# EAGLE design LEDTestBrd (EAGLE 6.5.0)
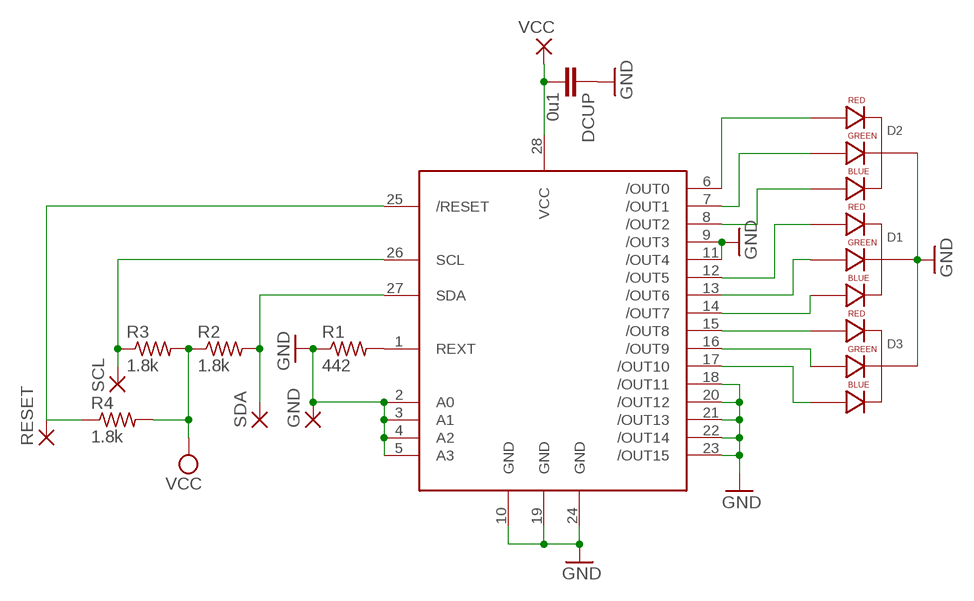
[diagram p0: schematic, sheet 1]

## Parts
D1  LED-RGB-CC-THRUCLEAR  [LED-RGB-THRU]
D2  LED-RGB-CC-THRUCLEAR  [LED-RGB-THRU]
D3  LED-RGB-CC-THRUCLEAR  [LED-RGB-THRU]
DCUP  0u1  CAP0402-CAP  [0402-CAP]
GND  2,15/1,0  [2,15/1,0]
R1  442  R-US_R0402  [R0402]
R2  1.8k  R-US_R0402  [R0402]
R3  1.8k  R-US_R0402  [R0402]
R4  1.8k  R-US_R0402  [R0402]
RESET  2,15/1,0  [2,15/1,0]
SCL  2,15/1,0  [2,15/1,0]
SDA  2,15/1,0  [2,15/1,0]
U$1  TLC59116  [TSSOP28]
VCC  2,15/1,0  [2,15/1,0]

## Nets
GND: D1.2(CATHODE) D2.2(CATHODE) D3.2(CATHODE) DCUP.1 GND.1(P) R1.1 U$1.2(A0) U$1.3(A1) U$1.4(A2) U$1.5(A3) U$1.9(/OUT3) U$1.10(GND) U$1.11(/OUT4) U$1.18(/OUT11) U$1.19(GND) U$1.20(/OUT12) U$1.21(/OUT13) U$1.22(/OUT14) U$1.23(/OUT15) U$1.24(GND)
N$1: D1.1(RED_CATHODE) U$1.12(/OUT5)
N$2: D2.1(RED_CATHODE) U$1.6(/OUT0)
N$3: D2.3(GREEN_CATHODE) U$1.7(/OUT1)
N$4: D2.4(BLUE_CATHODE) U$1.8(/OUT2)
N$5: D1.3(GREEN_CATHODE) U$1.13(/OUT6)
N$6: D1.4(BLUE_CATHODE) U$1.14(/OUT7)
N$7: D3.1(RED_CATHODE) U$1.15(/OUT8)
N$8: D3.3(GREEN_CATHODE) U$1.16(/OUT9)
N$9: D3.4(BLUE_CATHODE) U$1.17(/OUT10)
N$10: R1.2 U$1.1(REXT)
RESET: R4.1 RESET.1(P) U$1.25(/RESET)
SCL: R3.1 SCL.1(P) U$1.26(SCL)
SDA: R2.2 SDA.1(P) U$1.27(SDA)
VCC: DCUP.2 R2.1 R3.2 R4.2 U$1.28(VCC) VCC.1(P)

## Library data of the parts
D1-D3 = SparkFun-LED:LED-RGB-CC-THRU: RGB Through-hole common cathode LED SparkFun Storefront: COM-00105 (Clear) COM-09264 (Diffuse); PROD_ID: DIO-08418
DCUP = SparkFun-Capacitors:CAP: Capacitor Standard 0603 ceramic capacitor, and 0.1" leaded capacitor.
GND RESET SCL SDA VCC = wirepad:2,15/1,0: THROUGH-HOLE PAD
R1-R4 = resistor:R-US_: RESISTOR, American symbol
U$1 = tlc59116:TLC59116

## Board
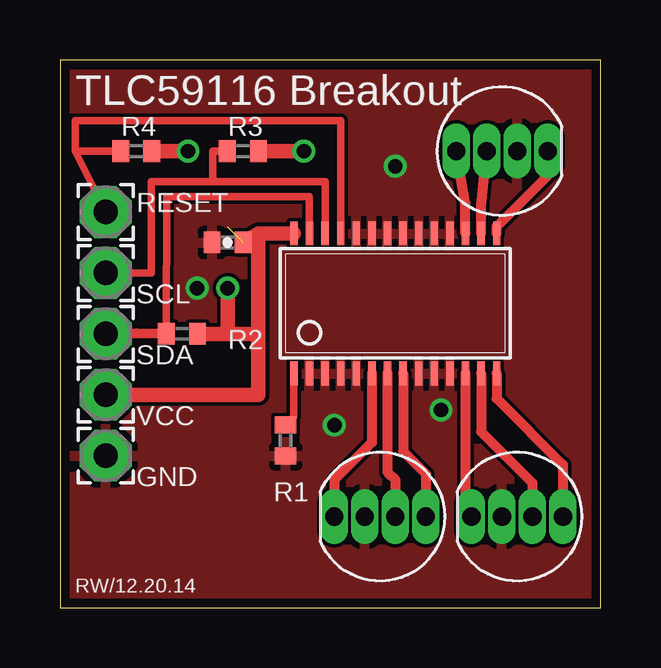
[diagram p1: board, top side]
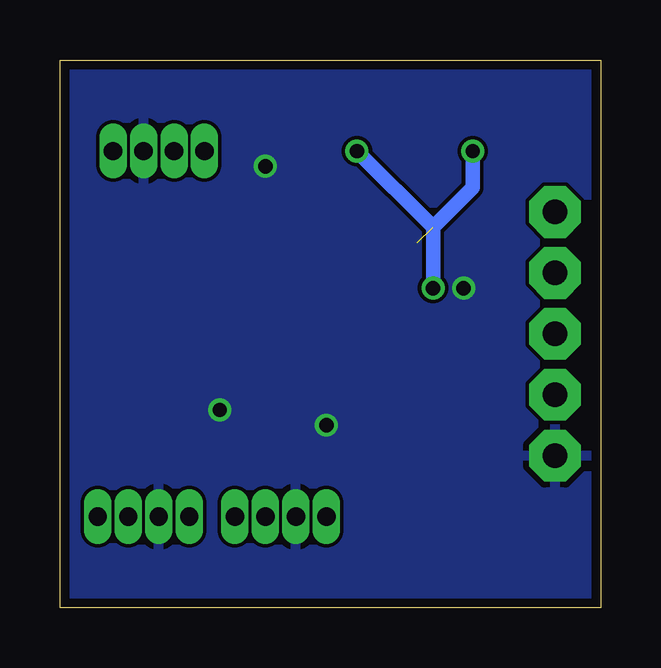
[diagram p2: board, bottom side, seen from below]

Size 22.53 x 22.85 mm. Coordinates in mm from the lower left corner, seen from the top.
Outline: 0,0 22.53,0 22.53,22.85 0,22.85 0,0
Copper layers (1*16): Top 0.0356mm / dielectric 1.5011mm / Bottom 0.0356mm
Design rules "LaenPCBOrder": minimum track width 6mil, minimum drill 13mil, track to track 6mil, track to pad 6mil, pad to pad 6mil, via to via 6mil, smd to smd 6mil, copper to edge 15mil, drill to drill 6mil, minimum pad ring 7mil, minimum via ring 7mil, stop-mask expansion 3mil, vias tented up to drill 0mil, thermal gap 10mil

### Footprints (pad centres in the part's own frame; a part is rotated, then mirrored left to right if it is on the bottom)
LED-RGB-THRU = drill 0.762 pad 0.889 long: 1 1.905,0; 2 0.635,0; 3 -0.635,0; 4 -1.905,0
0402-CAP = smd 0.7 x 0.9: 1 -0.65,0; 2 0.65,0
2,15/1,0 = drill 1.016 pad 2.159 octagon: 1 0,0
R0402 = smd 0.7 x 0.9: 1 -0.65,0; 2 0.65,0
TSSOP28 = smd 0.305 x 0.991: 1 -4.225,-2.918; 2 -3.575,-2.918; 3 -2.925,-2.918; 4 -2.275,-2.918; 5 -1.625,-2.918; 6 -0.975,-2.918; 7 -0.325,-2.918; 8 0.325,-2.918; 9 0.975,-2.918; 10 1.625,-2.918; 11 2.275,-2.918; 12 2.925,-2.918; 13 3.575,-2.918; 14 4.225,-2.918; 15 4.225,2.918; 16 3.575,2.918; 17 2.925,2.918; 18 2.275,2.918; 19 1.625,2.918; 20 0.975,2.918; 21 0.325,2.918; 22 -0.325,2.918; 23 -0.975,2.918; 24 -1.625,2.918; 25 -2.275,2.918; 26 -2.925,2.918; 27 -3.575,2.918; 28 -4.225,2.918

### Placement (x,y rotation side)
D1  19.05,3.81 180 top
D2  13.34,3.81 180 top
D3  18.41,19.05 0 top
DCUP  6.99,15.24 0 top
GND  1.91,6.35 0 top
R1  9.4,6.99 90 top
R2  5.08,11.43 180 top
R3  7.62,19.05 0 top
R4  3.17,19.05 0 top
RESET  1.91,16.51 0 top
SCL  1.91,13.97 0 top
SDA  1.91,11.43 0 top
U$1  13.97,12.7 0 top
VCC  1.91,8.89 0 top

### Tracks (layer width: path | path; a pad name or v marks a point on that pad's centre or on a via)
GND  (via drill 0.6)
  other vias: 15.88,8.26 11.43,7.62 5.71,13.34 13.97,18.41
  pour Top: 0,22.86 22.23,22.86 22.23,0 0,0
  pour Bottom: 0,22.86 22.23,22.86 22.23,0 0,0
N$1
  Top 0.406: U$1.12 16.89,4.06 D1.1
N$2
  Top 0.406: U$1.6 12.99,6.9 11.43,5.33 D2.1
N$3
  Top 0.406: U$1.7 13.64,5.66 13.97,5.33 D2.3
N$4
  Top 0.406: U$1.8 14.29,6.53 15.24,5.59 D2.4
N$5
  Top 0.406: U$1.13 17.55,7.35 19.68,5.21 D1.3
N$6
  Top 0.406: U$1.14 18.2,8.73 20.95,5.97 D1.4
N$7
  Top 0.406: U$1.15 18.2,15.91 20.32,18.03 D3.1
N$8
  Top 0.406: U$1.16 17.55,16.78 D3.3
N$9
  Top 0.406: U$1.17 16.89,16.89 D3.4
N$10
  Top 0.305: U$1.1 9.74,7.98 R1.2
RESET
  Top 0.305: U$1.25 11.7,20.32 0.64,20.32 0.64,19.05 | 0.64,19.05 RESET.1 | 0.64,19.05 R4.1
SCL
  Top 0.305: U$1.26 11.04,17.78 6.37,17.78 | 6.37,17.78 3.81,17.78 3.81,13.97 SCL.1 | 6.37,17.78 6.37,19.05 R3.1
SDA
  Top 0.305: U$1.27 10.39,17.14 4.45,17.14 R2.2
  Top 0.406: R2.2 3.19,11.45 SDA.1
VCC  (via drill 0.6)  (1 unrouted)
  Top 0.61: U$1.28 8.27,15.62 | 8.27,15.62 DCUP.2 | VCC.1 8.27,8.89 8.27,15.62 | 8.26,11.43 6.99,11.43 | 6.99,11.43 R2.1 | v6.99,13.34 6.99,11.43 | v5.33,19.05 R4.2 | v10.16,19.05 R3.2
  Bottom 0.61: v6.99,13.34 6.99,15.88 | 6.99,15.88 5.33,17.53 v5.33,19.05 | 6.99,15.88 v10.16,19.05

### Text on the board
tNames: TLC59116 Breakout | R4 | R3 | RESET | SCL | R2 | SDA | VCC | GND | R1 | RW/12.20.14